# EAGLE design circuit (EAGLE 6.6.0)
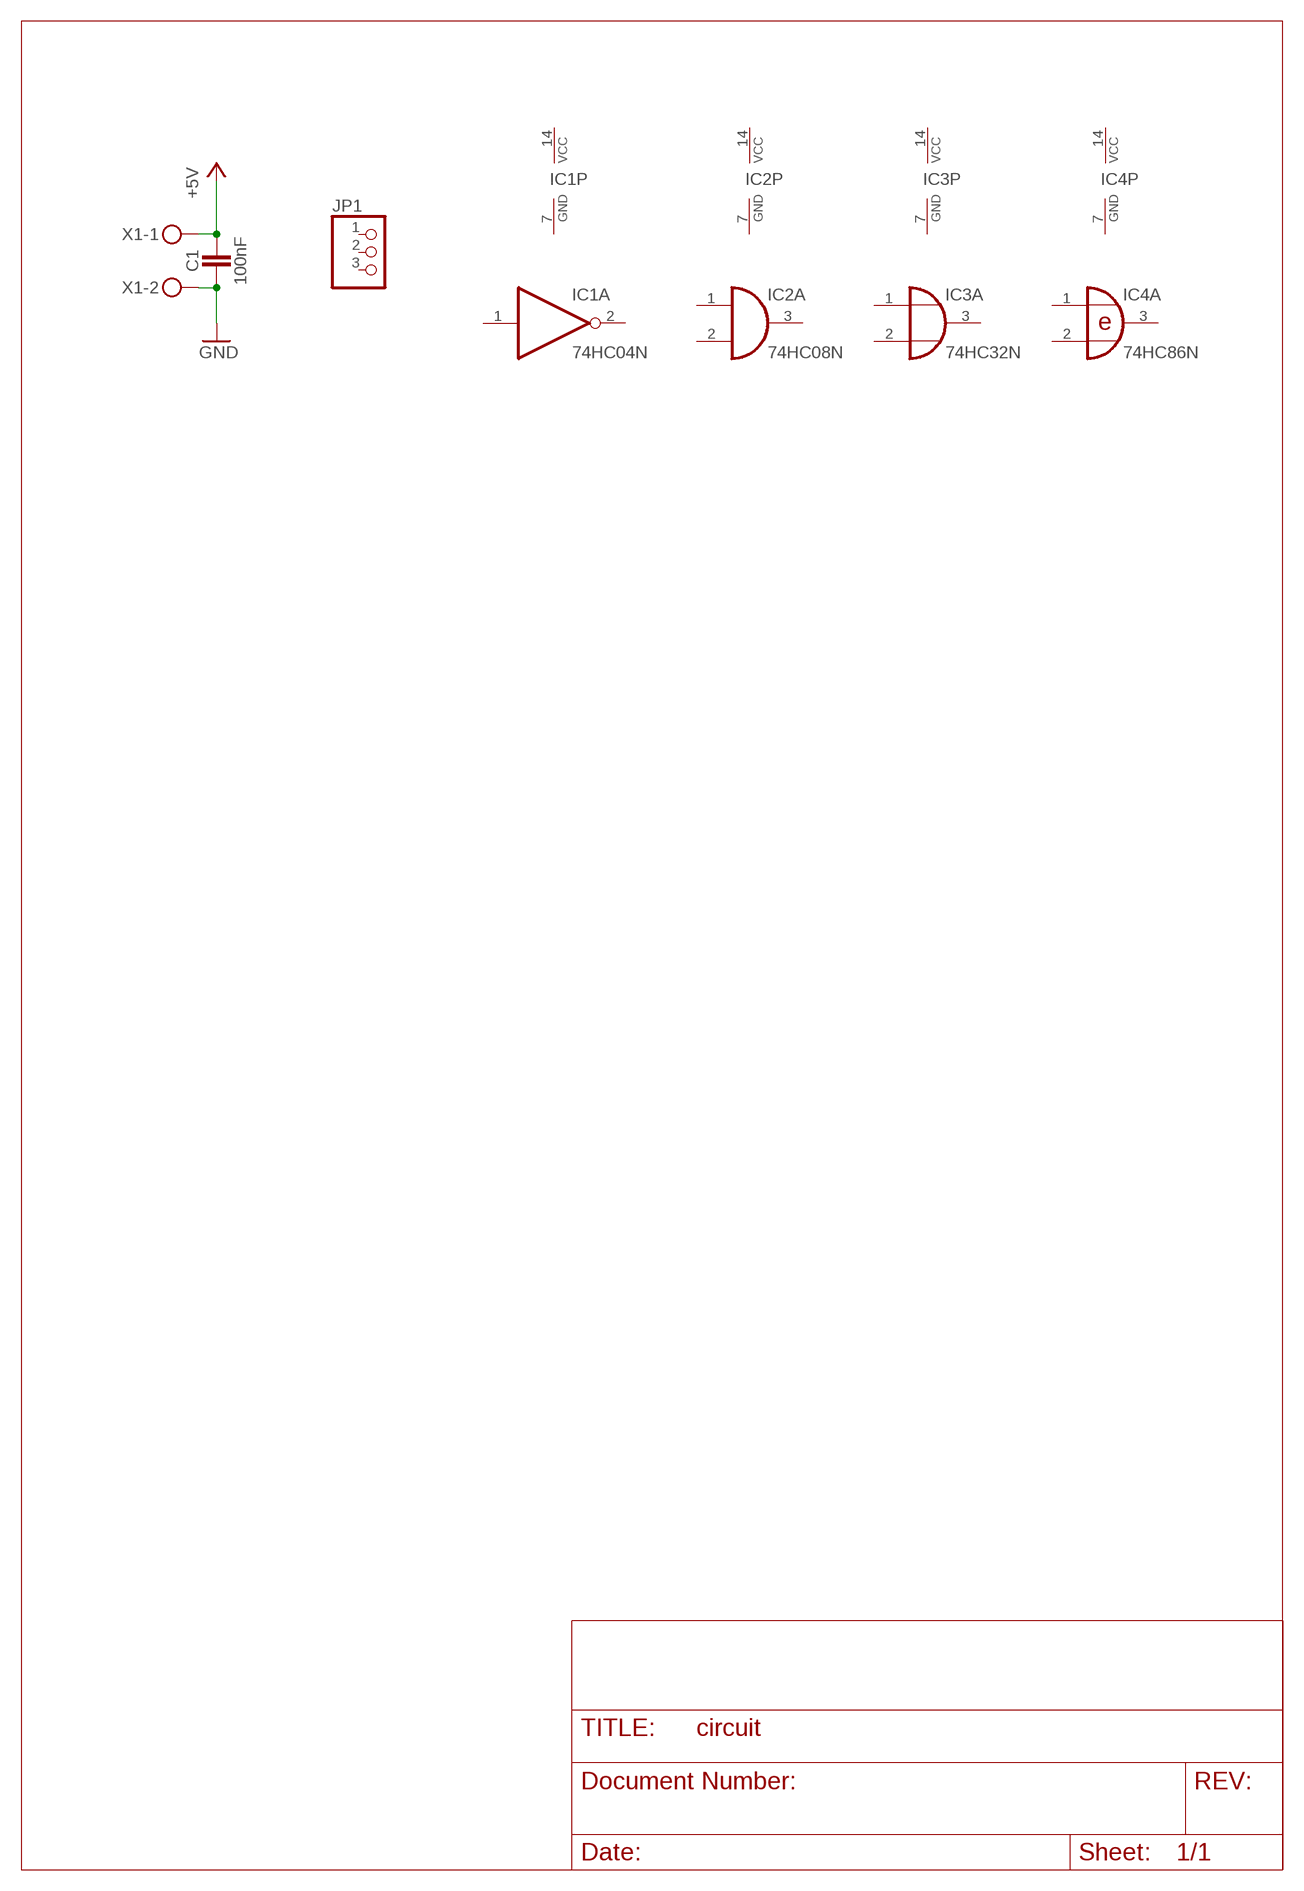
[diagram p0: schematic, sheet 1]

## Parts
C1  100nF  CAPACITATOR-5MM  [C_THT_3]
IC1  74HC04N  [DIL14]
IC2  74HC08N  [DIL14]
IC3  74HC32N  [DIL14]
IC4  74HC86N  [DIL14]
JP1  PINHD-1X3  [1X03]
X1  STECKER_SPG_2  [STECKER_SPG_2]

## Nets
+5V: C1.1 X1.1
GND: C1.2 X1.2
Unconnected: IC1.1(A:I) IC1.2(A:O) IC1.3(B:I) IC1.4(B:O) IC1.5(C:I) IC1.6(C:O) IC1.8(D:O) IC1.9(D:I) IC1.10(E:O) IC1.11(E:I) IC1.12(F:O) IC1.13(F:I) IC2.1(A:I0) IC2.2(A:I1) IC2.3(A:O) IC2.4(B:I0) IC2.5(B:I1) IC2.6(B:O) IC2.8(C:O) IC2.9(C:I0) IC2.10(C:I1) IC2.11(D:O) IC2.12(D:I0) IC2.13(D:I1) IC3.1(A:I0) IC3.2(A:I1) IC3.3(A:O) IC3.4(B:I0) IC3.5(B:I1) IC3.6(B:O) IC3.8(C:O) IC3.9(C:I0) IC3.10(C:I1) IC3.11(D:O) IC3.12(D:I0) IC3.13(D:I1) IC4.1(A:I0) IC4.2(A:I1) IC4.3(A:O) IC4.4(B:I0) IC4.5(B:I1) IC4.6(B:O) IC4.8(C:O) IC4.9(C:I0) IC4.10(C:I1) IC4.11(D:O) IC4.12(D:I0) IC4.13(D:I1) JP1.1 JP1.2 JP1.3

## Power pins joined to a net without a drawn wire
GND: IC1.7(P:GND) IC2.7(P:GND) IC3.7(P:GND) IC4.7(P:GND)
VCC: IC1.14(P:VCC) IC2.14(P:VCC) IC3.14(P:VCC) IC4.14(P:VCC)

## Library data of the parts
C1 = robo_ag:CAPACITATOR: Kondensator
IC1 = 74xx-eu:74*04: Hex INVERTER
IC2 = 74xx-eu:74*08: Quad 2-input AND gate
IC3 = 74xx-eu:74*32: Quad 2-input OR gate
IC4 = 74xx-eu:74*86: Quad 2-input EXCLUSIVE-OR (XOR) gate
JP1 = pinhead:PINHD-1X3: PIN HEADER
X1 = robo_ag:STECKER_SPG_2: Anschlussklemme Reichelt:AKL 101-02 Nicht Anreihbar Reichelt:AKL 057-02 Anreihbar

## Board
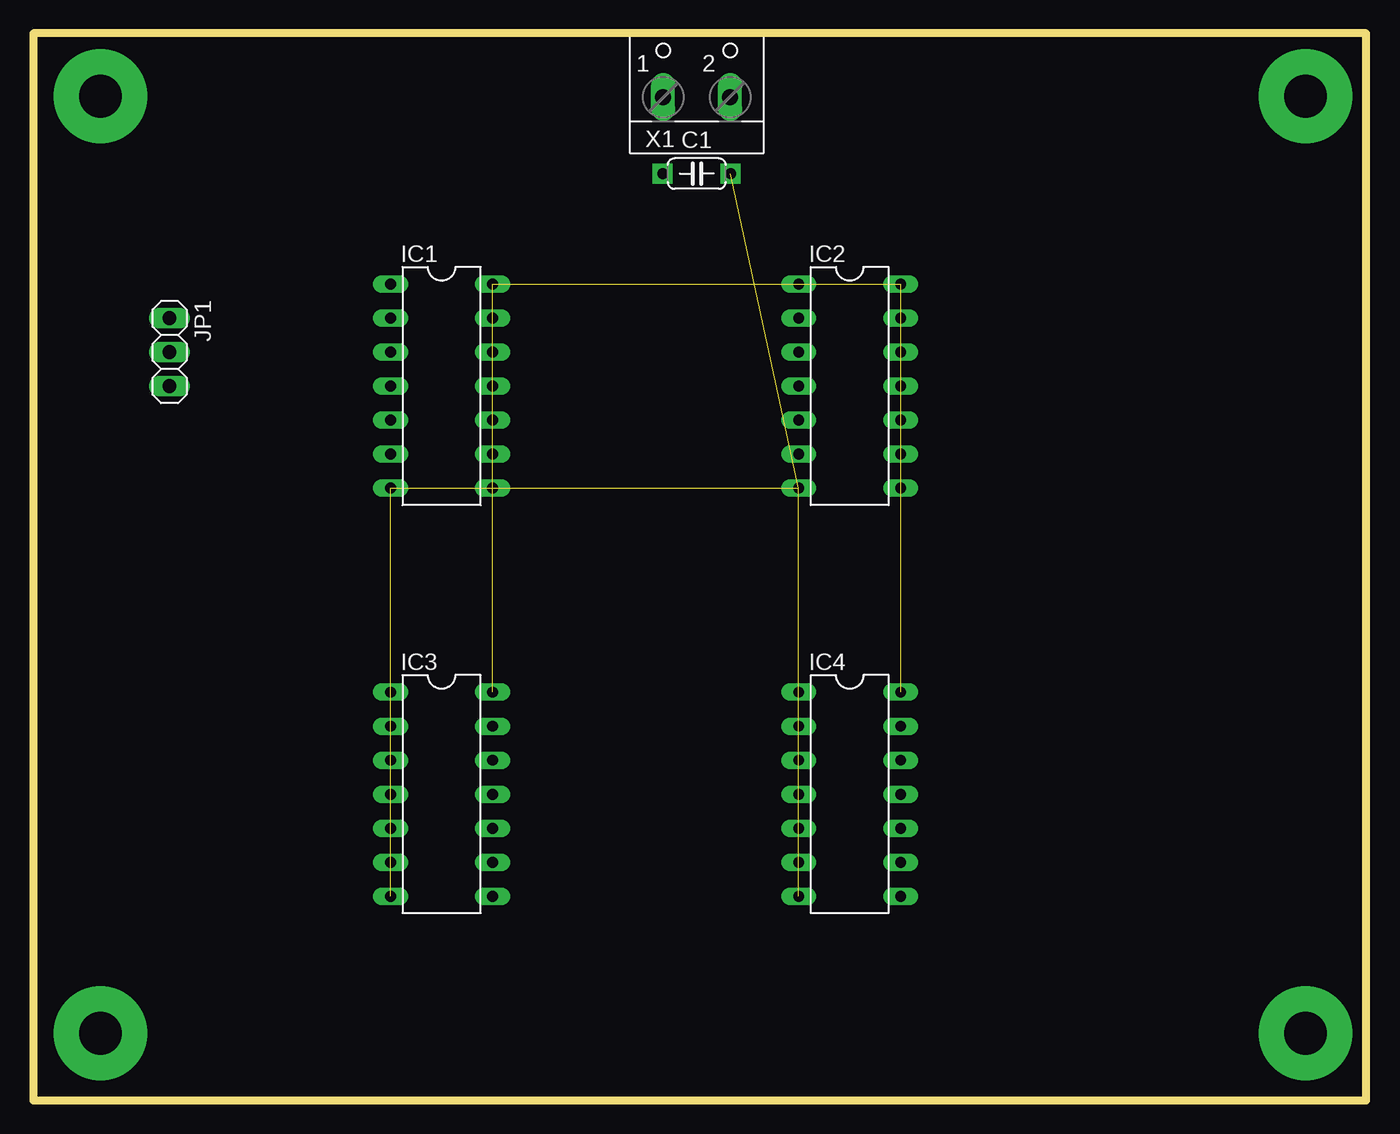
[diagram p1: board, top side]
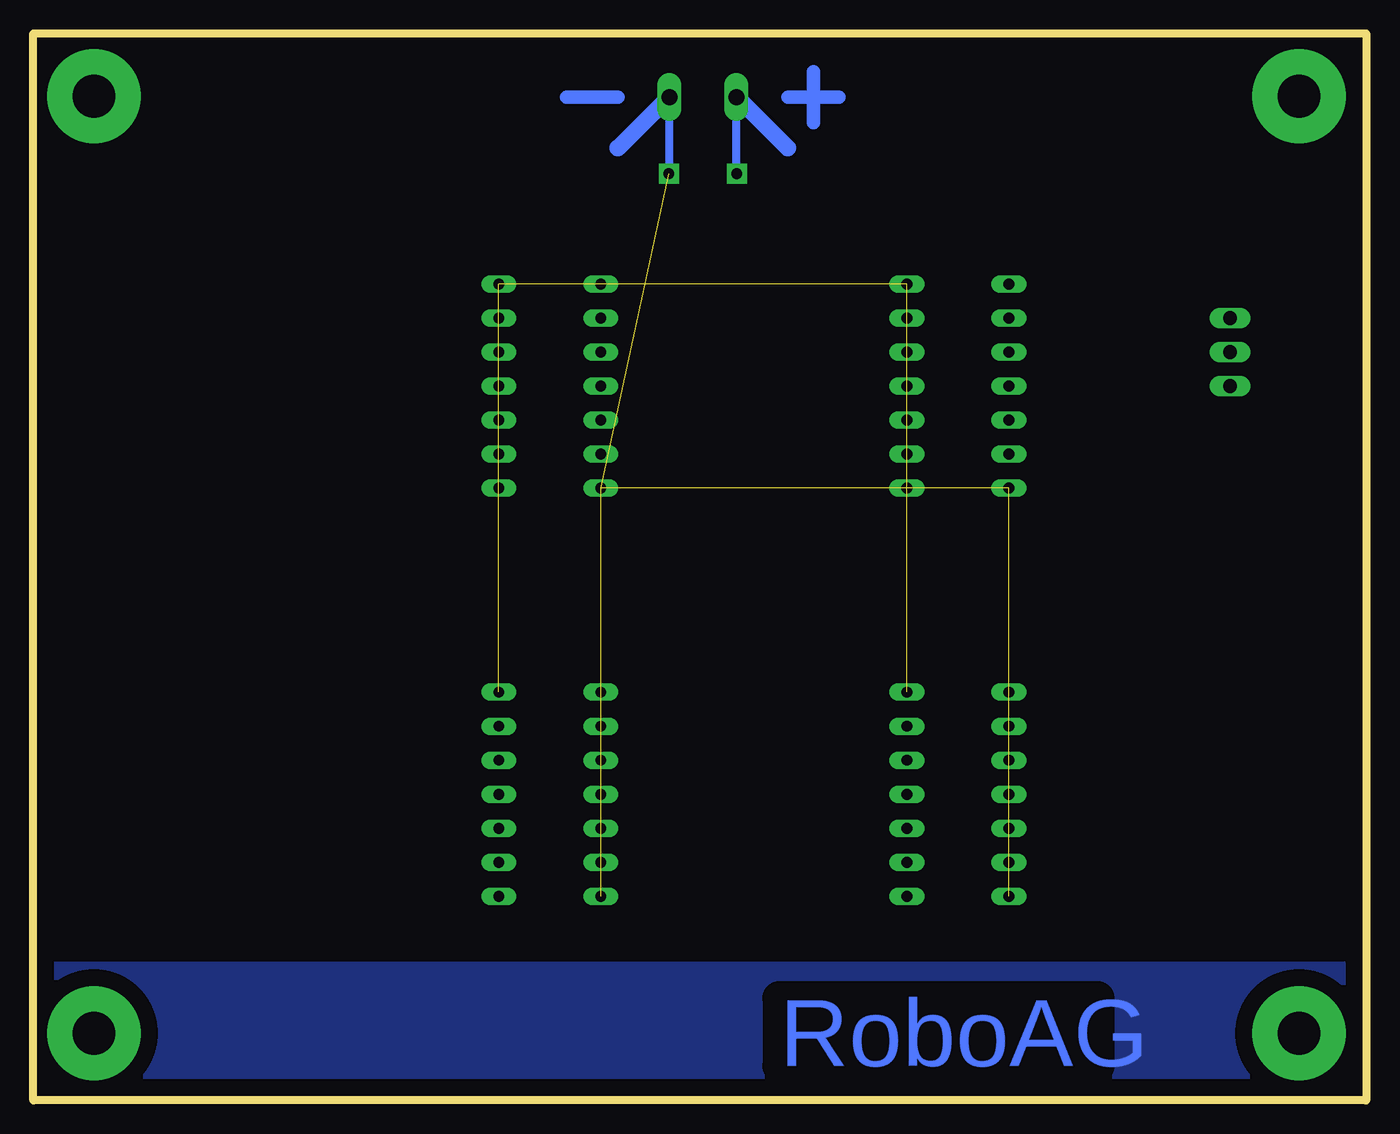
[diagram p2: board, bottom side, seen from below]

Size 99.52 x 79.68 mm. Coordinates in mm from the lower left corner, seen from the top.
Outline: 0,0 99.52,0 99.52,79.68 0,79.68 0,0
Copper layers (1*16): Top 0.035mm / dielectric 1.5mm / Bottom 0.035mm
Design rules "default": minimum track width 10mil, minimum drill 24mil, track to track 8mil, track to pad 8mil, pad to pad 8mil, via to via 8mil, smd to smd 8mil, copper to edge 40mil, drill to drill 8mil, minimum pad ring 10mil, minimum via ring 8mil, stop-mask expansion 4mil, vias tented up to drill 0mil, thermal gap 10mil

### Footprints (pad centres in the part's own frame; a part is rotated, then mirrored left to right if it is on the bottom)
C_THT_3 = drill 0.8 pad 1.5 square: 1 -2.54,0; 2 2.54,0
DIL14 = drill 0.813 long: 1 -7.62,-3.81; 2 -5.08,-3.81; 3 -2.54,-3.81; 4 0,-3.81; 5 2.54,-3.81; 6 5.08,-3.81; 7 7.62,-3.81; 8 7.62,3.81; 9 5.08,3.81; 10 2.54,3.81; 11 0,3.81; 12 -2.54,3.81; 13 -5.08,3.81; 14 -7.62,3.81
1X03 = drill 1.016 long: 1 -2.54,0; 2 0,0; 3 2.54,0
STECKER_SPG_2 = drill 1.194 long: 1 -2.5,-1.27; 2 2.5,-1.27

### Placement (x,y rotation side)
C1  49.53,69.22 0 top
IC1  30.48,53.34 270 top
IC2  60.96,53.34 270 top
IC3  30.48,22.86 270 top
IC4  60.96,22.86 270 top
JP1  10.16,55.88 270 top
X1  49.53,76.2 0 top

### Tracks (layer width: path | path; a pad name or v marks a point on that pad's centre or on a via)
+5V
  Bottom 0.61: C1.1 47.03,69.22 X1.1
  Bottom 1.016: X1.1 46.99,74.93
  Bottom 1.27: 46.99,74.93 43.18,71.12
GND  (4 unrouted)
  Bottom 0.61: C1.2 52.03,69.22 X1.2
  Bottom 1.016: X1.2 52.07,74.93
  Bottom 1.27: 52.07,74.93 55.88,71.12
  pour Bottom (isolate 1.27): 0,10.16 99.85,10.16 99.85,0 0,0
N$8
  Bottom 1.016: 55.88,74.93 59.69,74.93
N$9
  Bottom 1.016: 43.18,74.93 39.37,74.93
N$11
  Bottom 1.016: 41.27,73.03 41.27,76.83
N$27  (via drill 3.2 pad 7)
  other vias: 5,5
N$28  (via drill 3.2 pad 7)
  other vias: 95,5
N$29  (via drill 3.2 pad 7)
  other vias: 95,75
N$30  (via drill 3.2 pad 7)
  other vias: 5,75
VCC  (3 unrouted)

### Text on the board
Bottom: RoboAG